# Altium project PCB_Project.PrjPcb
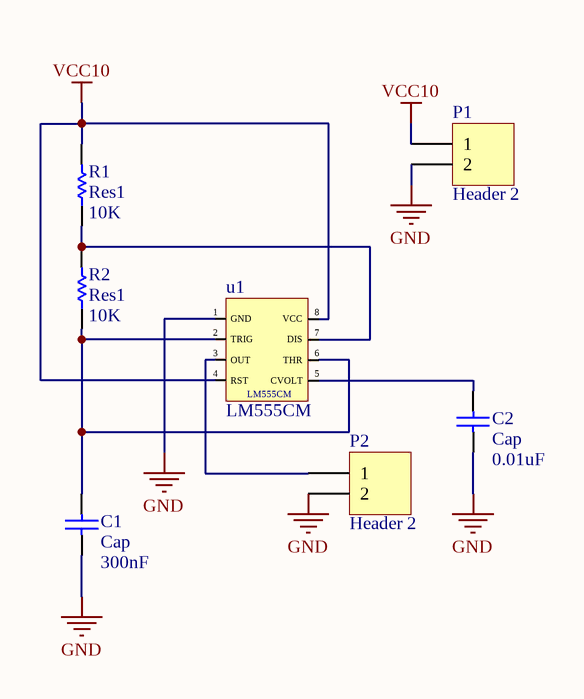
[diagram p0: Sheet1.SchDoc]
1 sheet, 7 parts. Net scope: global (net labels, ports and power ports of the same name join across sheets).
Board file: PCB1.PcbDoc

## Sheet Sheet1.SchDoc
size A4

### Parts
C1  Cap  value 300nF  [RAD-0.3]
C2  Cap  value 0.01uF  [RAD-0.3]
P1  Header 2  [HDR1X2]
P2  Header 2  [HDR1X2]
R1  Res1  value 10K  [AXIAL-0.3]
R2  Res1  value 10K  [AXIAL-0.3]
u1  LM555CM  [LM555CM]

### Nets
GND: C1.1 C2.1 P1.2 P2.2 u1.1(GND)
VCC10: P1.1 R1.2 u1.4(RST) u1.8(VCC)
NetC1_2: C1.2 R2.1 u1.2(TRIG) u1.6(THR)
NetC2_2: C2.2 u1.5(CVOLT)
NetP2_1: P2.1 u1.3(OUT)
NetR1_1: R1.1 R2.2 u1.7(DIS)

### Library data of the parts
C1 C2 = Cap: Capacitor; Published: 8-Jun-2000; LatestRevisionDate: 17-Jul-2002; LatestRevisionNote: Re-released for DXP Platform.; PackageReference: RAD-0.3; Publisher: Altium Limited; PackageDescription: Radial Cap, Thru-Hole; 2 Leads; 0.3 in Pin Spacing
P1 P2 = Header 2: Header, 2-Pin; LatestRevisionDate: 17-Jul-2002; LatestRevisionNote: Re-released for DXP Platform.; Publisher: Altium Limited
R1 R2 = Res1: Resistor; Published: 8-Jun-2000; LatestRevisionDate: 17-Jul-2002; LatestRevisionNote: Re-released for DXP Platform.; PackageReference: AXIAL-0.3; Publisher: Altium Limited; PackageDescription: Axial Device, Thru-Hole; 2 Leads; 0.3 in Pin Spacing
u1 = LM555CM: LM555CM IC; Created By: Cyrine SFAR; Date created: 23-01-2019